# EAGLE design arduino_isp (EAGLE 6.4)
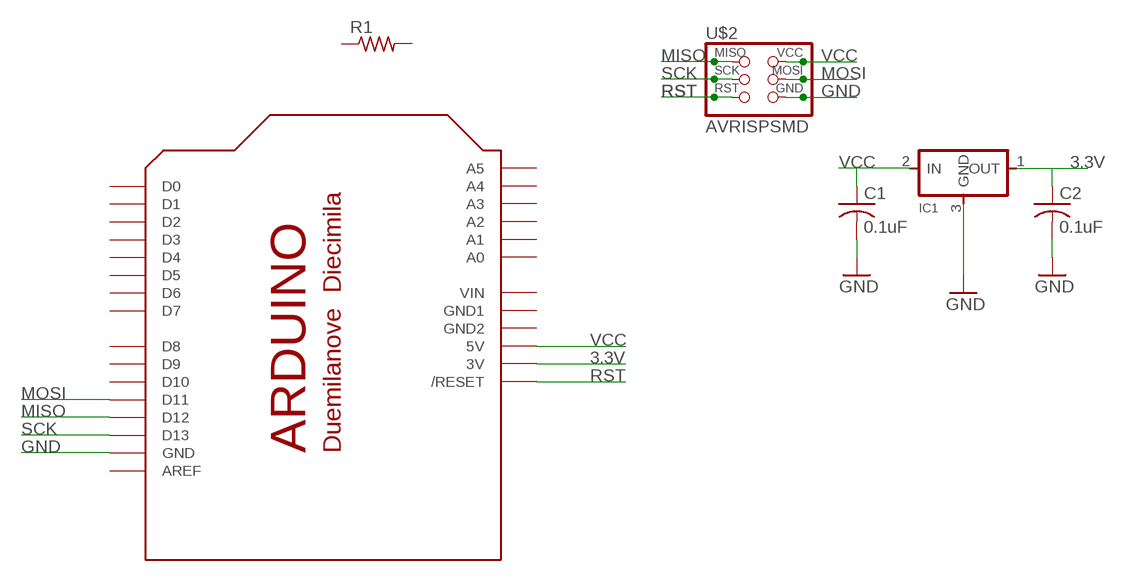
[diagram p0: schematic, sheet 1]

## Parts
C1  0.1uF  C-USC1206  [C1206]
C2  0.1uF  C-USC1206  [C1206]
IC1  REGULATORSOT23  [SOT23]
R1  R-US_M1206  [M1206]
U$1  ARDUINODUEMILANOVE  [ARDUINO]
U$2  AVRISPSMD  [2X03SMD]

## Nets
3.3V: C2.1 IC1.1(OUT) U$1.3V
GND: C1.2 C2.2 IC1.3(GND) U$1.GND U$2.6(GND)
MISO: U$1.D12 U$2.1(MISO)
MOSI: U$1.D11 U$2.4(MOSI)
RST: U$1.RESET(/RESET) U$2.5(RST)
SCK: U$1.D13 U$2.3(SCK)
VCC: C1.1 IC1.2(IN) U$1.5V U$2.2(VCC)
Unconnected: R1.1 R1.2 U$1.A0 U$1.A1 U$1.A2 U$1.A3 U$1.A4 U$1.A5 U$1.AREF U$1.D0 U$1.D1 U$1.D2 U$1.D3 U$1.D4 U$1.D5 U$1.D6 U$1.D7 U$1.D8 U$1.D9 U$1.D10

## Power pins joined to a net without a drawn wire
GND1: U$1.GND1
GND2: U$1.GND2
VIN: U$1.VIN

## Library data of the parts
C1 C2 = 01_adafruit:C-US: CAPACITOR, American symbol
IC1 = 01_fab:REGULATOR
R1 = 01_adafruit:R-US_: RESISTOR, American symbol
U$1 = 01_adafruit:ARDUINO: Arduino Diecimila/Duemilanove Make a shield with ease, this package has all the named pins as well as the two mounting drill holes and an outline of the USB and DC power connector. The outline is on the DIMENSION layer, so if your board house uses it they will cut the outline to match. http://www.ladyada.net/library/pcb/eaglelibrary.html
U$2 = 01_FAB_Hello:AVRISP

## Board
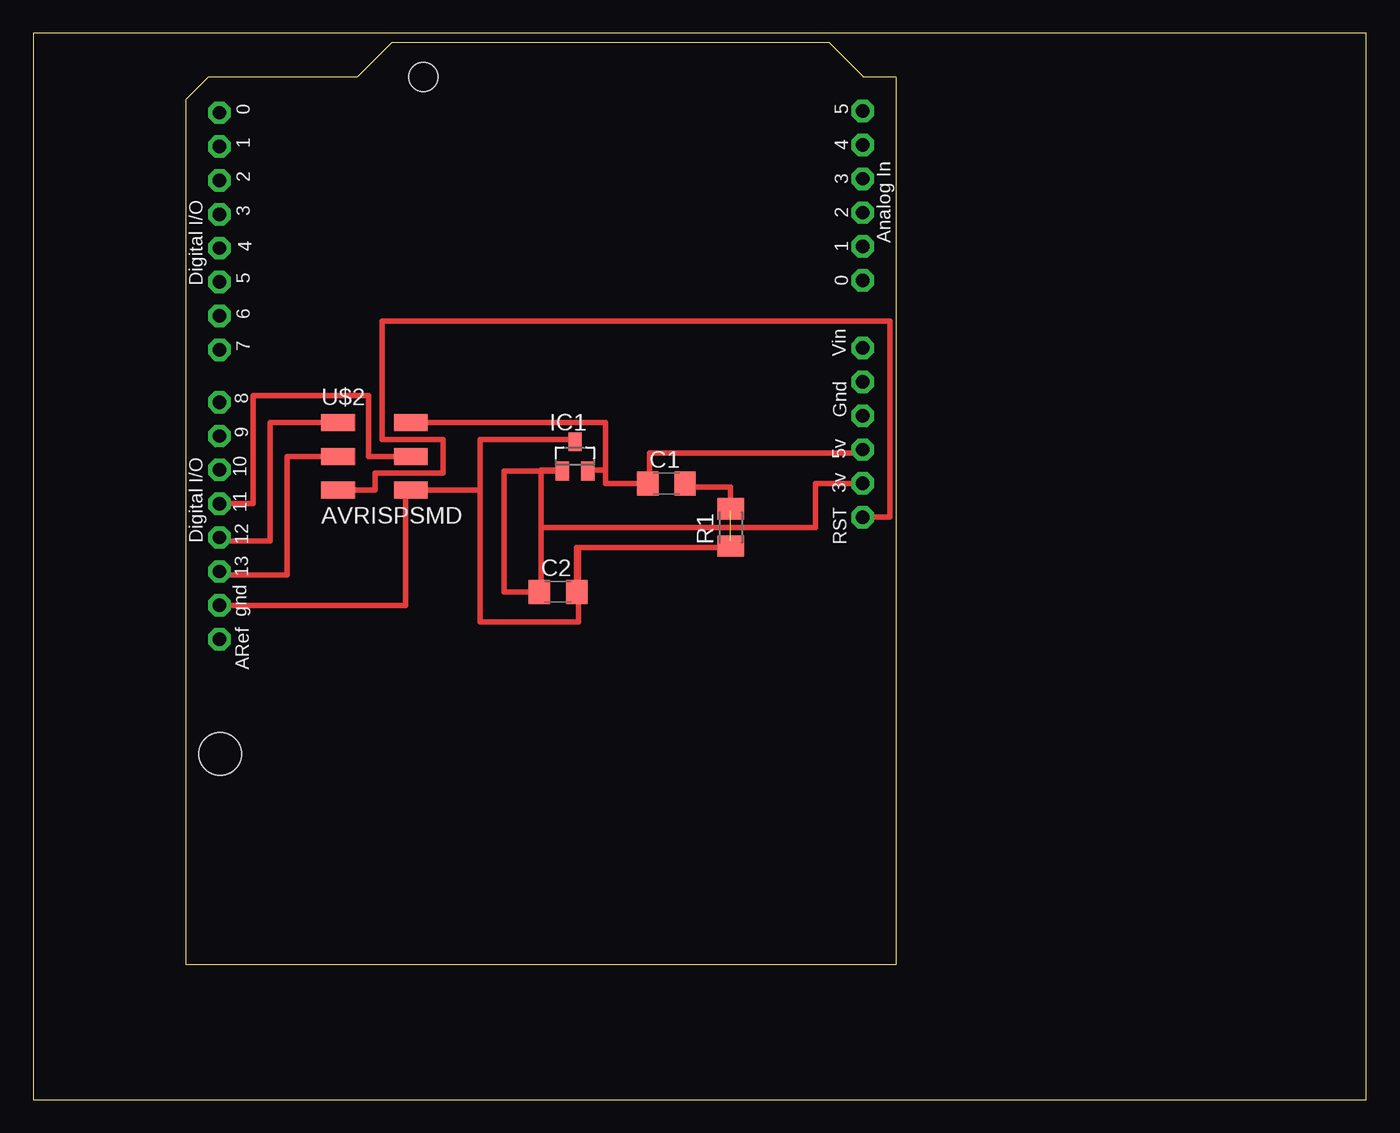
[diagram p1: board, top side]

Size 100 x 80 mm. Coordinates in mm from the lower left corner, seen from the top.
Outline: 0,0 100,0 100,80 0,80 0,0
Copper layers (1*16): Top 0.035mm / dielectric 1.5mm / Bottom 0.035mm
Design rules "default": minimum track width 10mil, minimum drill 24mil, track to track 8mil, track to pad 8mil, pad to pad 8mil, via to via 8mil, smd to smd 8mil, copper to edge 40mil, drill to drill 8mil, minimum pad ring 10mil, minimum via ring 8mil, stop-mask expansion 4mil, vias tented up to drill 0mil, thermal gap 10mil

### Footprints (pad centres in the part's own frame; a part is rotated, then mirrored left to right if it is on the bottom)
C1206 = smd 1.6 x 1.8: 1 -1.4,0; 2 1.4,0
SOT23 = smd 1 x 1.4: 1 -0.95,-1.1; 2 0.95,-1.1; 3 0,1.1
M1206 = smd 1.6 x 2: 1 -1.4,0; 2 1.4,0
ARDUINO = drill 1 pad 1.676 octagon: 3V 36.068,2.54; 5V 38.608,2.54; A0 51.308,2.54; A1 53.848,2.54; A2 56.388,2.54; A3 58.928,2.54; A4 61.468,2.54; A5 64.008,2.54; AREF 24.384,50.8; D0 63.881,50.8; D1 61.341,50.8; D2 58.801,50.8; D3 56.261,50.8; D4 53.721,50.8; D5 51.181,50.8; D6 48.641,50.8; D7 46.101,50.8; D8 42.164,50.8; D9 39.624,50.8; D10 37.084,50.8; D11 34.544,50.8; D12 32.004,50.8; D13 29.464,50.8; GND 26.924,50.8; GND1 43.688,2.54; GND2 41.148,2.54; RESET 33.528,2.54; VIN 46.228,2.54 | hole 3.2: 15.758,50.754 | hole 2.2: 66.558,35.514
2X03SMD = smd 2.54 x 1.27: 1 -2.54,2.54; 2 2.92,2.54; 3 -2.54,0; 4 2.92,0; 5 -2.54,-2.54; 6 2.92,-2.54

### Placement (x,y rotation side)
C1  47.5,46.23 0 top
C2  39.37,38.1 0 top
IC1  40.64,48.26 0 top
R1  52.32,42.93 90 top
U$1  64.77,10.16 90 top
U$2  25.4,48.26 0 top

### Tracks (layer width: path | path; a pad name or v marks a point on that pad's centre or on a via)
3.3V
  Top 0.406: C2.1 35.31,38.1 35.31,47.16 IC1.1 39.88,47.16 39.88,47.24 38.1,47.24 38.1,42.93 | 38.1,38.35 38.1,42.93 | 38.1,42.93 58.67,42.93 58.67,46.23 U$1.3V
GND  (1 unrouted)
  Top 0.406: C1.2 48.77,46.23 48.77,45.97 52.32,45.97 52.32,44.2 | 40.89,41.4 52.32,41.4 52.32,41.91 | C2.2 40.77,41.4 40.89,41.4 | U$1.GND 27.94,37.08 27.94,45.72 U$2.6 33.53,45.72 | 33.53,45.72 33.53,49.53 40.64,49.53 IC1.3 | 40.89,41.4 40.89,35.81 33.53,35.81 33.53,45.72
MISO
  Top 0.406: U$2.1 17.78,50.8 17.78,41.91 13.97,41.91 U$1.D12
MOSI
  Top 0.406: U$2.4 25.15,48.26 25.15,52.83 16.51,52.83 16.51,44.7 U$1.D11
RST
  Top 0.406: U$1.RESET 64.26,43.69 64.26,58.42 26.16,58.42 26.16,49.53 30.73,49.53 30.73,46.99 25.65,46.99 25.65,45.72 U$2.5
SCK
  Top 0.406: U$2.3 19.05,48.26 19.05,39.37 13.97,39.37 U$1.D13
VCC
  Top 0.406: U$2.2 42.93,50.8 42.93,47.24 | 42.93,47.24 41.59,47.24 IC1.2 | 42.93,47.24 42.93,46.23 C1.1 46.23,46.23 46.23,48.51 62.23,48.51 U$1.5V